# Altium project project_12.PrjPcb
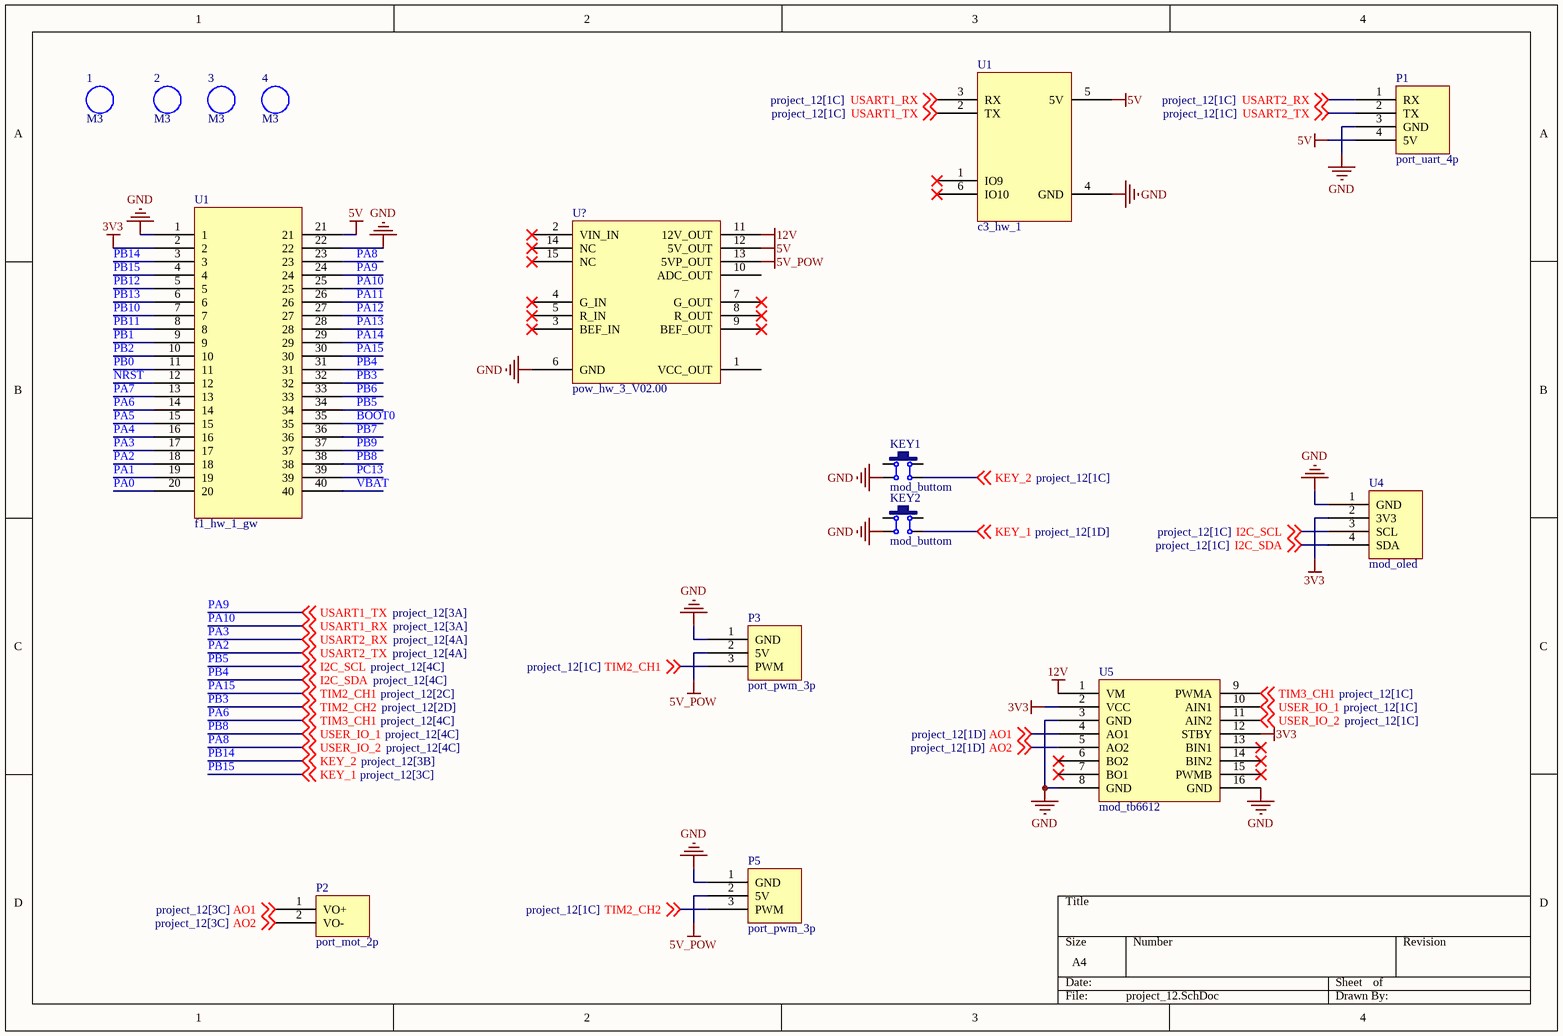
[diagram p0: project_12.SchDoc]
1 sheet, 15 parts. Net scope: global (net labels, ports and power ports of the same name join across sheets).
Board file: project_12.PcbDoc

## Sheet project_12.SchDoc
size A4; SheetNumber: 1; SheetTotal: 1

### Parts
(Parts that share a designator on the sheet are numbered #1, #2 ... from top to bottom, then left to right.)
1  M3  [M3 125X200]
2  M3  [M3 125X200]
3  M3  [M3 125X200]
4  M3  [M3 125X200]
KEY1  mod_buttom  [MOD_BUTTOM]
KEY2  mod_buttom  [MOD_BUTTOM]
P1  port_uart_4p  [XH2.54_4P]
P2  port_mot_2p  [XH2.54_2P]
P3  port_pwm_3p  [XH2.54_3P]
P5  port_pwm_3p  [XH2.54_3P]
U1#1  c3_hw_1  [C3_HW_1]
U1#2  f1_hw_1_gw  [F1_HW_1_GW]
U4  mod_oled  [mod_oled]
U5  mod_tb6612  [MOD_TB6612]
U?  pow_hw_3_V02.00  [POW_HW_3_2]

### Nets
3V3: U1#2.2 U4.2(3V3) U5.2(VCC) U5.12(STBY)
5V: P1.4(5V) U1#1.5(5V) U1#2.21 U?.12(5V_OUT)
5V_POW: P3.2(5V) P5.2(5V) U?.13(5VP_OUT)
12V: U5.1(VM) U?.11(12V_OUT)
GND: KEY1.4 KEY2.4 P1.3(GND) P3.1(GND) P5.1(GND) U1#1.4(GND) U1#2.1 U1#2.22 U4.1(GND) U5.3(GND) U5.8(GND) U5.16(GND) U?.6(GND)
AO1: P2.1(VO+) U5.4(AO1) ; off-sheet AO1
AO2: P2.2(VO-) U5.5(AO2) ; off-sheet AO2
BOOT0: U1#2.35
NRST: U1#2.12
PA0: U1#2.20
PA1: U1#2.19
PA2: P1.2(TX) U1#2.18 ; off-sheet USART2_TX  [also labelled USART2_TX]
PA3: P1.1(RX) U1#2.17 ; off-sheet USART2_RX  [also labelled USART2_RX]
PA4: U1#2.16
PA5: U1#2.15
PA6: U1#2.14 U5.9(PWMA) ; off-sheet TIM3_CH1  [also labelled TIM3_CH1]
PA7: U1#2.13
PA8: U1#2.23 U5.11(AIN2) ; off-sheet USER_IO_2  [also labelled USER_IO_2]
PA9: U1#1.2(TX) U1#2.24 ; off-sheet USART1_TX  [also labelled USART1_TX]
PA10: U1#1.3(RX) U1#2.25 ; off-sheet USART1_RX  [also labelled USART1_RX]
PA11: U1#2.26
PA12: U1#2.27
PA13: U1#2.28
PA14: U1#2.29
PA15: P3.3(PWM) U1#2.30 ; off-sheet TIM2_CH1  [also labelled TIM2_CH1]
PB0: U1#2.11
PB1: U1#2.9
PB2: U1#2.10
PB3: P5.3(PWM) U1#2.32 ; off-sheet TIM2_CH2  [also labelled TIM2_CH2]
PB4: U1#2.31 U4.4(SDA) ; off-sheet I2C_SDA  [also labelled I2C_SDA]
PB5: U1#2.34 U4.3(SCL) ; off-sheet I2C_SCL  [also labelled I2C_SCL]
PB6: U1#2.33
PB7: U1#2.36
PB8: U1#2.38 U5.10(AIN1) ; off-sheet USER_IO_1  [also labelled USER_IO_1]
PB9: U1#2.37
PB10: U1#2.7
PB11: U1#2.8
PB12: U1#2.5
PB13: U1#2.6
PB14: KEY1.3 U1#2.3 ; off-sheet KEY_2  [also labelled KEY_2]
PB15: KEY2.3 U1#2.4 ; off-sheet KEY_1  [also labelled KEY_1]
PC13: U1#2.39
VBAT: U1#2.40

Not connected (* = marked no-connect by the designer): KEY1 1 2; KEY2 1 2; U1#1 1(IO9)* 6(IO10)*; U5 6(BO2)* 7(BO1)* 13(BIN1)* 14(BIN2)* 15(PWMB)*; U? 1(VCC_OUT) 2(VIN_IN)* 3(BEF_IN)* 4(G_IN)* 5(R_IN)* 7(G_OUT)* 8(R_OUT)* 9(BEF_OUT)* 10(ADC_OUT) 14(NC)* 15(NC)*

### Library data of the parts
1-4 = prot_m3: m3铜柱孔; BOM名称: 铜柱孔; 版权归属: 源创客; 学习资源: www.ooocke.com
KEY1 KEY2 = mod_buttom: 6*6*4.3按键
P1 = port_uart_4p: 串口接口/SPP蓝牙模块 / XH2.54弯排针4p/4p排母
P2 = port_mot_2p: 开环直流电机接口 / XH2.54弯排针2p
P3 P5 = port_pwm_3p: 舵机接口 / XH2.54弯排针3p
U1#1 = c3_hw_1: ESP32C3蓝牙模块 / 6p排母
U4 = mod_oled: 外购屏幕模块
U5 = mod_tb6612: TB6612模块 / 8p排母*2
U? = pow_hw_3_V02.00: 两路降压电源模块一路通用电源模块